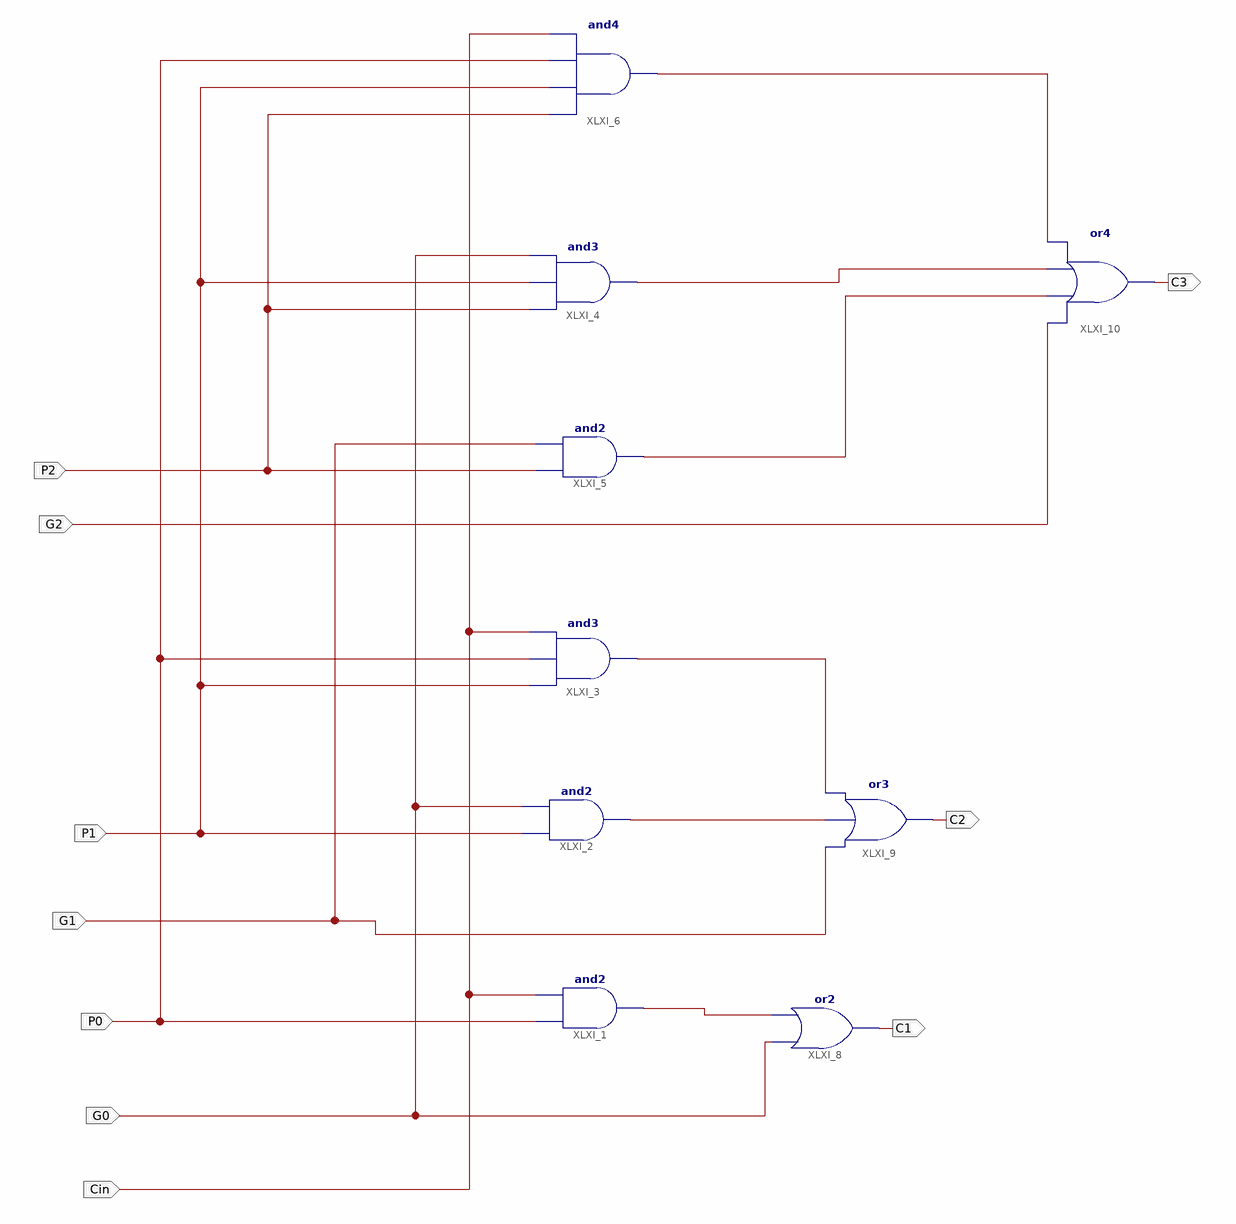
[diagram p0: schematic sheet 1]
// Xilinx ISE schematic CLAs.sch (spartan3e) as structural Verilog: 9 symbols, 10 ports
module CLAs (
  input  G0,
  input  Cin,
  input  P0,
  input  G1,
  input  P1,
  input  G2,
  input  P2,
  output C1,
  output C2,
  output C3
);

  wire XLXN_4, XLXN_36, XLXN_37, XLXN_41, XLXN_42, XLXN_43;

  and XLXI_1 (XLXN_4, P0, Cin);
  and XLXI_3 (XLXN_37, P1, P0, Cin);
  and XLXI_2 (XLXN_36, P1, G0);
  and XLXI_5 (XLXN_41, P2, G1);
  and XLXI_4 (XLXN_42, P2, P1, G0);
  and XLXI_6 (XLXN_43, P2, P1, P0, Cin);
  or XLXI_8 (C1, G0, XLXN_4);
  or XLXI_9 (C2, G1, XLXN_36, XLXN_37);
  or XLXI_10 (C3, G2, XLXN_41, XLXN_42, XLXN_43);
endmodule
